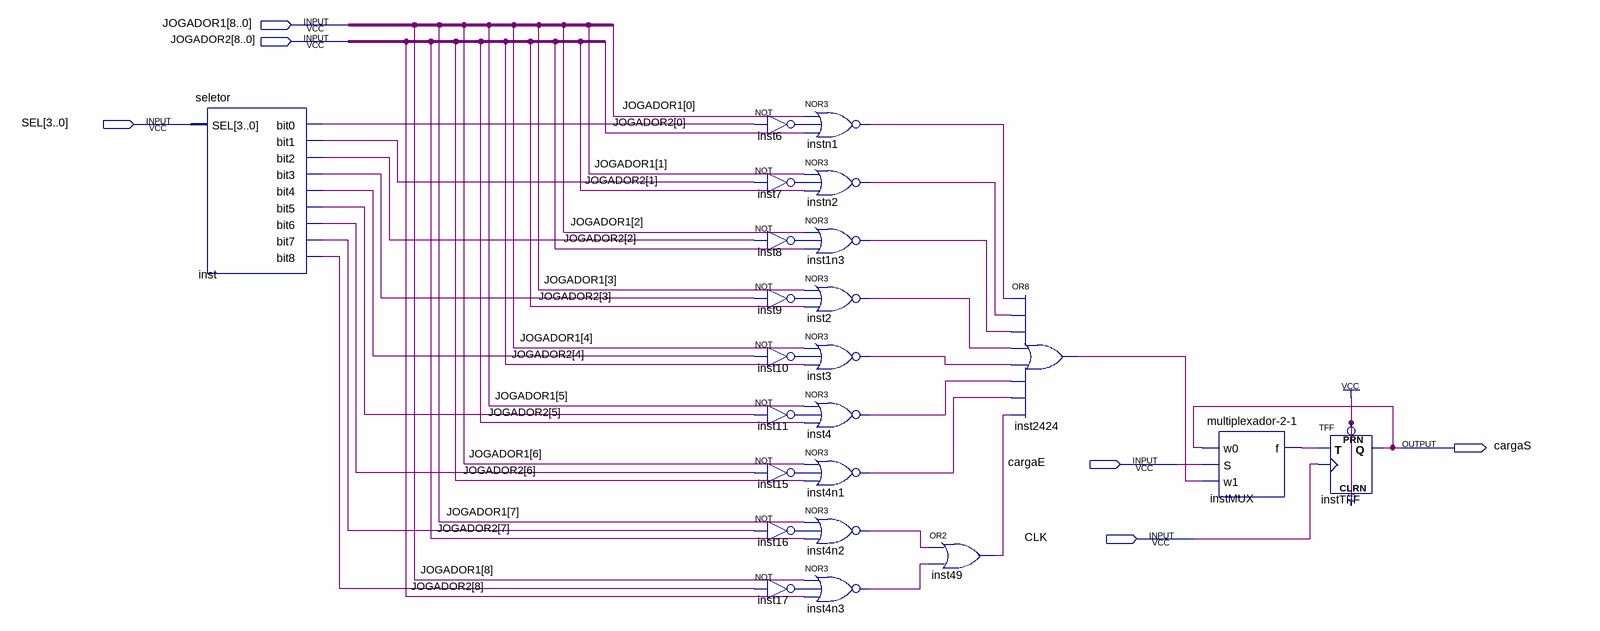
[diagram p0: schematic sheet]
// Quartus schematic verificar_se_disponivel.bdf as structural Verilog: 23 symbols, 6 pins
module verificar_se_disponivel (
  input  [8:0] JOGADOR1,
  input  [8:0] JOGADOR2,
  input  [3:0] SEL,
  input  cargaE,
  input  CLK,
  output cargaS
);

  wire inst1n3_out, inst2_out, inst3_out, inst4_out, inst4n1_out, inst4n2_out, inst4n3_out, inst6_out,
       inst7_out, inst8_out, inst9_out, inst10_out, inst11_out, inst15_out, inst16_out, inst17_out,
       inst49_out, inst2424_out, inst_bit0, inst_bit1, inst_bit2, inst_bit3, inst_bit4, inst_bit5, inst_bit6,
       inst_bit7, inst_bit8, instMUX_f, instn1_out, instn2_out;

  seletor inst (
    .SEL(SEL), .bit0(inst_bit0), .bit1(inst_bit1), .bit2(inst_bit2), .bit3(inst_bit3), .bit4(inst_bit4),
    .bit5(inst_bit5), .bit6(inst_bit6), .bit7(inst_bit7), .bit8(inst_bit8));
  not inst6 (inst6_out, inst_bit0);
  not inst7 (inst7_out, inst_bit1);
  not inst8 (inst8_out, inst_bit2);
  not inst9 (inst9_out, inst_bit3);
  not inst10 (inst10_out, inst_bit4);
  not inst11 (inst11_out, inst_bit5);
  not inst15 (inst15_out, inst_bit6);
  not inst16 (inst16_out, inst_bit7);
  not inst17 (inst17_out, inst_bit8);
  nor instn1 (instn1_out, JOGADOR1[0], inst6_out, JOGADOR2[0]);
  nor instn2 (instn2_out, JOGADOR1[1], inst7_out, JOGADOR2[1]);
  nor inst1n3 (inst1n3_out, JOGADOR1[2], inst8_out, JOGADOR2[2]);
  nor inst2 (inst2_out, JOGADOR1[3], inst9_out, JOGADOR2[3]);
  nor inst3 (inst3_out, JOGADOR1[4], inst10_out, JOGADOR2[4]);
  nor inst4 (inst4_out, JOGADOR1[5], inst11_out, JOGADOR2[5]);
  nor inst4n1 (inst4n1_out, JOGADOR1[6], inst15_out, JOGADOR2[6]);
  nor inst4n2 (inst4n2_out, JOGADOR1[7], inst16_out, JOGADOR2[7]);
  nor inst4n3 (inst4n3_out, JOGADOR1[8], inst17_out, JOGADOR2[8]);
  or inst49 (inst49_out, inst4n2_out, inst4n3_out);
  or inst2424 (inst2424_out, instn1_out, instn2_out, inst1n3_out, inst2_out, inst3_out, inst4_out, inst4n1_out, inst49_out);
  \multiplexador-2-1  instMUX (.w0(cargaS), .S(cargaE), .w1(inst2424_out), .f(instMUX_f));
  TFF instTFF (.PRN(1'b1), .CLRN(1'b1), .T(instMUX_f), .CLK(CLK), .Q(cargaS));
endmodule
